# Altium schematic sheet GrainDryer.SchDoc
size A3; SheetNumber: 1; SheetTotal: 1
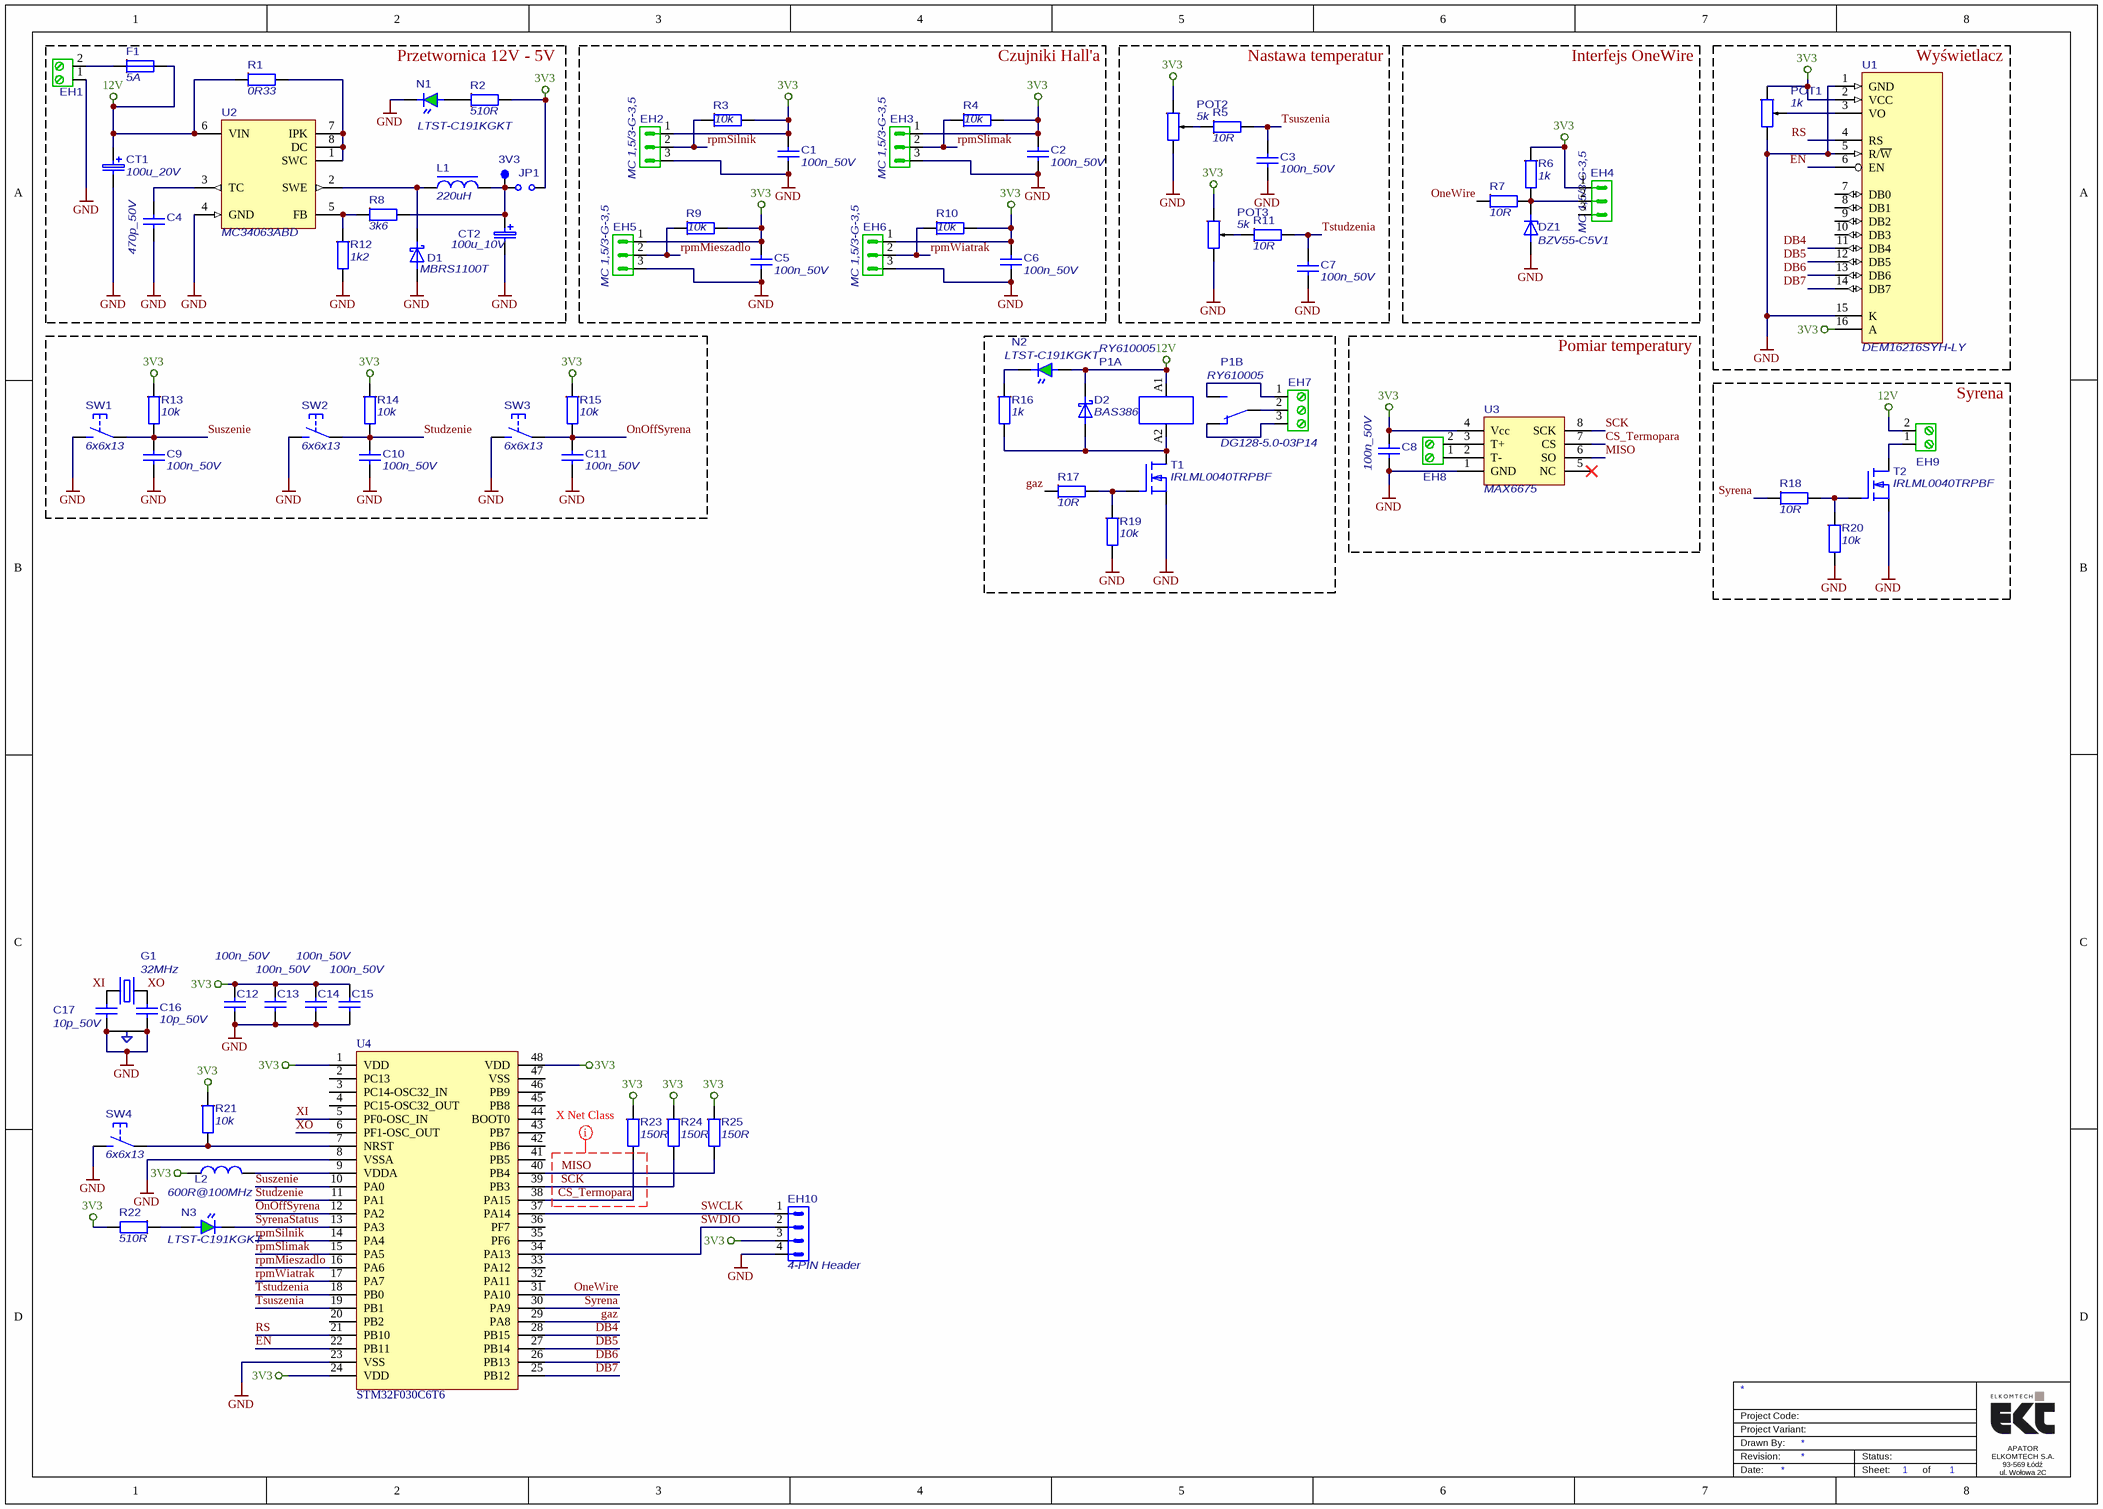
[diagram p0: GrainDryer.SchDoc]

## Parts
3V3  TP_THT  [TP3]  (value not drawn)  (no BOM)
C1  100n_50V  [0603C]
C2  100n_50V  [0603C]
C3  100n_50V  [0603C]
C4  470p_50V  [1206C]
C5  100n_50V  [0603C]
C6  100n_50V  [0603C]
C7  100n_50V  [0603C]
C8  100n_50V  [0603C]
C9  100n_50V  [0603C]
C10  100n_50V  [0603C]
C11  100n_50V  [0603C]
C12  100n_50V  [0603C]
C13  100n_50V  [0603C]
C14  100n_50V  [0603C]
C15  100n_50V  [0603C]
C16  10p_50V  [0603H]
C17  10p_50V  [0603H]
CT1  100u_20V  [7243]
CT2  100u_10V  [7243]
D1  MBRS1100T  [CASE403A-03]
D2  BAS386  [MICROMELF]
DZ1  BZV55-C5V1  [SOD80D]
EH1  MKDSN 1,5/2-5,08  [2xMKDSN1.5]  (value not drawn)
EH2  MC 1,5/3-G-3,5  [MC 1,5/3-G-3,5]
EH3  MC 1,5/3-G-3,5  [MC 1,5/3-G-3,5]
EH4  MC 1,5/3-G-3,5  [MC 1,5/3-G-3,5]
EH5  MC 1,5/3-G-3,5  [MC 1,5/3-G-3,5]
EH6  MC 1,5/3-G-3,5  [MC 1,5/3-G-3,5]
EH7  DG128-5.0-03P14  [DG128-5.0-03P14]
EH8  MKDSN 1,5/2-5,08  [2xMKDSN1.5]  (value not drawn)
EH9  MKDSN 1,5/2-5,08  [2xMKDSN1.5]  (value not drawn)
EH10  4-PIN Header  [SIP4]
F1  5A  [20x5mm fuse holder]
G1  32MHz  [XTAL2520]
JP1  JP_2H_NO  [TIN2]  (value not drawn)  (no BOM)
L1  220uH  [SRR0604]
L2  600R@100MHz  [1206L]
N1  LTST-C191KGKT  [LED0603GREEN]
N2  LTST-C191KGKT  [LED0603GREEN]
N3  LTST-C191KGKT  [LED0603GREEN]
P1  RY610005  [RY6100XX]  (parts A,B of 2)
POT1  1k  [3312J]
POT2  5k  [RK09 vertical]
POT3  5k  [RK09 vertical]
R1  0R33  [2512R]
R2  510R  [0603R]
R3  10k  [0603R]
R4  10k  [0603R]
R5  10R  [0603R]
R6  1k  [0603R]
R7  10R  [0603R]
R8  3k6  [1206R]
R9  10k  [0603R]
R10  10k  [0603R]
R11  10R  [0603R]
R12  1k2  [1206R]
R13  10k  [0603R]
R14  10k  [0603R]
R15  10k  [0603R]
R16  1k  [0603R]
R17  10R  [0603R]
R18  10R  [0603R]
R19  10k  [0603R]
R20  10k  [0603R]
R21  10k  [0603R]
R22  510R  [0603R]
R23  150R  [0603R]
R24  150R  [0603R]
R25  150R  [0603R]
SW1  6x6x13  [SW6x6x13]
SW2  6x6x13  [SW6x6x13]
SW3  6x6x13  [SW6x6x13]
SW4  6x6x13  [SW6x6x13]
T1  IRLML0040TRPBF  [SOT23]
T2  IRLML0040TRPBF  [SOT23]
U1  DEM16216SYH-LY  [LCD2004]
U2  MC34063ABD  [so8]
U3  MAX6675  [SO8]
U4  STM32F030C6T6  [LQFP48(0.5)]

## Blocks framed on the sheet
Przetwornica 12V - 5V: 3V3 C4 CT1 CT2 D1 EH1 F1 JP1 L1 N1 R1 R2 R8 R12 U2
Czujniki Hall'a: C1 C2 C5 C6 EH2 EH3 EH5 EH6 R3 R4 R9 R10
Nastawa temperatur: C3 C7 POT2 POT3 R5 R11
Interfejs OneWire: DZ1 EH4 R6 R7
Wyświetlacz: POT1 U1
Pomiar temperatury: C8 EH8 U3
Syrena: EH9 R18 R20 T2

## Nets
3V3: C1.1 C2.1 C5.1 C6.1 C8.1 C12.1 C13.1 C14.1 C15.1 EH2.1 EH3.1 EH4.1 EH5.1 EH6.1 EH10.3 JP1.2 L2.1 POT1.1 POT2.1 POT3.1 R2.2 R3.2 R4.2 R6.1 R9.2 R10.2 R13.1 R14.1 R15.1 R21.1 R22.2 R23.1 R24.1 R25.1 U1.2(VCC) U1.16(A) U3.4(Vcc) U4.1(VDD) U4.24(VDD) U4.48(VDD)
12V: CT1.1 D2.1(K) EH9.2 F1.2 N2.2(A) P1.A1 R1.1 U2.6(VIN)
GND: C1.2 C2.2 C3.2 C4.1 C5.2 C6.2 C7.2 C8.2 C9.2 C10.2 C11.2 C12.2 C13.2 C14.2 C15.2 C16.2 C17.2 CT1.2 CT2.2 D1.2(A) DZ1.2(A) EH1.1 EH2.3 EH3.3 EH5.3 EH6.3 EH10.4 G1.2(GND) G1.4(GND) N1.1(K) POT1.3 POT2.3 POT3.3 R12.2 R19.2 R20.2 SW1.1 SW2.1 SW3.1 SW4.1 T1.2(S) T2.2(S) U1.1(GND) U1.5(R/~{W}) U1.15(K) U2.4(GND) U3.1(GND) U4.8(VSSA) U4.23(VSS)
CS_Termopara: R23.2 U3.7(CS) U4.38(PA15)
DB4: U1.11(DB4) U4.28(PB15)
DB5: U1.12(DB5) U4.27(PB14)
DB6: U1.13(DB6) U4.26(PB13)
DB7: U1.14(DB7) U4.25(PB12)
EN: U1.6(EN) U4.22(PB11)
gaz: R17.1 U4.29(PA8)
MISO: R25.2 U3.6(SO) U4.40(PB4)
OneWire: R7.1 U4.31(PA10)
OnOffSyrena: C11.1 R15.2 SW3.2 U4.12(PA2)
rpmMieszadlo: EH5.2 R9.1 U4.16(PA6)
rpmSilnik: EH2.2 R3.1 U4.14(PA4)
rpmSlimak: EH3.2 R4.1 U4.15(PA5)
rpmWiatrak: EH6.2 R10.1 U4.17(PA7)
RS: U1.4(RS) U4.21(PB10)
SCK: R24.2 U3.8(SCK) U4.39(PB3)
Studzenie: C10.1 R14.2 SW2.2 U4.11(PA1)
Suszenie: C9.1 R13.2 SW1.2 U4.10(PA0)
SWCLK: EH10.1 U4.37(PA14)
SWDIO: EH10.2 U4.34(PA13)
Syrena: R18.1 U4.30(PA9)
SyrenaStatus: N3.1(K) U4.13(PA3)
Tstudzenia: C7.1 R11.2 U4.18(PB0)
Tsuszenia: C3.1 R5.2 U4.19(PB1)
XI: C17.1 G1.1 U4.5(PF0-OSC_IN)
XO: C16.1 G1.3 U4.6(PF1-OSC_OUT)
Net3V3_1: 3V3.1 CT2.1 JP1.1 L1.1 R8.2
NetC4_2: C4.2 U2.3(TC)
NetD1_1: D1.1(K) L1.2 U2.2(SWE)
NetD2_2: D2.2(A) P1.A2 R16.2 T1.3(D)
NetDZ1_1: DZ1.1(K) EH4.2 R6.2 R7.2
NetEH1_2: EH1.2 F1.1
NetEH7_1: EH7.1 P1.14
NetEH7_2: EH7.2 P1.11
NetEH7_3: EH7.3 P1.12
NetEH8_1: EH8.1 U3.2(T-)
NetEH8_2: EH8.2 U3.3(T+)
NetEH9_1: EH9.1 T2.3(D)
NetL2_2: L2.2 U4.9(VDDA)
NetN1_2: N1.2(A) R2.1
NetN2_1: N2.1(K) R16.1
NetN3_2: N3.2(A) R22.1
NetPOT1_2: POT1.2 U1.3(VO)
NetPOT2_2: POT2.2 R5.1
NetPOT3_2: POT3.2 R11.1
NetR1_2: R1.2 U2.1(SWC) U2.7(IPK) U2.8(DC)
NetR8_1: R8.1 R12.1 U2.5(FB)
NetR17_2: R17.2 R19.1 T1.1(G)
NetR18_2: R18.2 R20.1 T2.1(G)
NetR21_2: R21.2 SW4.2 U4.7(NRST)

Not connected (* = marked no-connect by the designer): EH4 3; U1 7(DB0) 8(DB1) 9(DB2) 10(DB3); U3 5(NC)*; U4 2(PC13) 3(PC14-OSC32_IN) 4(PC15-OSC32_OUT) 20(PB2) 32(PA11) 33(PA12) 35(PF6) 36(PF7) 41(PB5) 42(PB6) 43(PB7) 44(BOOT0) 45(PB8) 46(PB9) 47(VSS)

## Layout directives
net class X Net Class: CS_Termopara, MISO, SCK

## Notes on the sheet
- Drawn By:
- Revision:
- Project Code:
- Project Variant:
- Status:
- Date:
- Sheet:
- of
- APATOR ELKOMTECH S.A.
  93-569 Łódź
  ul. Wołowa 2C

## Library data of the parts
3V3 = TP THT Dia: 0,7mm: Test Point, THT; Component Type: REF
C1-C3 C5-C15 = 100n 10% 50V 0603 [Metric: 1608] X7R: Capacitor; Manufacturer: MULTICOMP; Manufacturer Part Number: MC0603B104K500CT; Tolerance: 10; Voltage Rating: 50; Pick and Place: 100n_50V_MULTICOMP_MC0603B104K500CT; AE ERP: ZCS000046; Component Type: SMD; Value: 100n_50V
C4 = 470p 5% 50V 1206 [Metric: 3216]: Capacitor; Manufacturer: KEMET; Manufacturer Part Number: C1206C471J5GAC7800; Tolerance: 5; Voltage Rating: 50; Pick and Place: 470p_50V_KEMET_C1206C471J5GAC7800; AE ERP: ZCS000038; Component Type: SMD; Value: 470p_50V
C16 C17 = 10p 5% 50V 0603 [Metric: 1608] C0G: Capacitor; Manufacturer: KEMET; Manufacturer Part Number: C0603C100J5GACTU; Tolerance: 5; Voltage Rating: 50; Pick and Place: 10p_50V_KEMET_C0603C100J5GACTU; AE ERP: ZCS000060; Component Type: SMD; Value: 10p_50V
CT1 = 100u 10% 20V 2917 [Metric: 7343] 0R085: Tantalum Capacitor; Manufacturer: AVX; Manufacturer Part Number: TPSD107K020R0085; Pick and Place: 100u_20V_AVX_TPSD107K020R0085; Component Type: SMD; Value: 100u_20V
CT2 = 100u 10% 10V 2917 [Metric: 7343] 0R065: Tantalum Capacitor; Manufacturer: AVX; Manufacturer Part Number: TPSD107K010R0065; Tolerance: 10; Pick and Place: 100u_10V_AVX_TPSD107K010R0065; AE ERP: ZCTS00014; Component Type: SMD; Voltage Rating: 10; Value: 100u_10V
D1 = MBRS1100T3G 100V 1A SMB: Schottky Diodes & Rectifiers; Manufacturer: ON SEMICONDUCTOR; Pick and Place: ON SEMICONDUCTOR_MBRS1100T3G; AE ERP: ZDS000019; Component Type: SMD; Manufacturer Part Number: MBRS1100T3G; Value: MBRS1100T
D2 = BAS386-TR 50V 0,1A Micro MELF: Schottky Diode; Manufacturer: VISHAY; Pick and Place: VISHAY_BAS386-TR; AE ERP: ZDS000055; Component Type: SMD; Manufacturer Part Number: BAS386-TR; Value: BAS386
DZ1 = BZV55-C5V1 5,1V 2uA 500mW SOD-80: Zener Diodes; Manufacturer: NXP; Current: 2u; Power: 0,5; Pick and Place: NXP_BZV55-C5V1; AE ERP: ZDS000064; Component Type: SMD; Manufacturer Part Number: BZV55-C5V1; Value: BZV55-C5V1; Supplier 1: Farnell; Supplier Part Number 1: 1097202
EH1 EH8 EH9 = MKDSN 1,5/2-5,08 1729128: Term. block 13,5A 250V; Manufacturer: PHOENIX CONTACT; Pick and Place: PHOENIX CONTACT_1729128; Component Type: THT; Manufacturer Part Number: 1729128; Value: MKDSN 1,5/2-5,08
EH2-EH6 = MC 1,5/3-G-3,5 1844223: Header 8A 250V; Manufacturer: PHOENIX CONTACT; Pick and Place: PHOENIX CONTACT_1844223; AE ERP: ZPH000303; Component Type: THT; Manufacturer Part Number: 1844223; Value: MC 1,5/3-G-3,5
EH7 = DG128-5.0-03P14: Term. block 5mm; Manufacturer: DEGSON ELECTRONICS; Manufacturer Part Number: DG128-5.0-03P-14-00A(H); Pick and Place: DEGSON ELECTRONICS_DG128-5.0-03P-14-00A(H); AE ERP: ZE0000057; Component Type: THT; Value: DG128-5.0-03P14
EH10 = 4-PIN Header 2,54 DS1021-1*4SF1-1: 1x4, Male, Pitch 2,54mm; Manufacturer: CONNFLY; Pick and Place: CONNFLY_DS1021-1*4SF1-1; Component Type: THT; Manufacturer Part Number: DS1021-1*4SF1-1; Value: 4-PIN Header
F1 = 5A fuse 20x5mm: Fuse; Manufacturer: multicom; Manufacturer Part Number: MC000827; Pick and Place: 5A_multicom_MC000827; Component Type: THT; Value: 5A
G1 = 32.00M-SMDXT224 25MHz 30ppm -V 2,6x2,1: 25MHz; ±30ppm; 20pF; SMD; 2,6x2,1x0,65mm; Manufacturer: YIC; Pick and Place: YIC_32.00M-SMDXT224; Component Type: SMD; Manufacturer Part Number: 32.00M-SMDXT224; Value: 32MHz
JP1 = JP 2H NO: Jumper 2-contact, normally open
L1 = 220uH 0,25A 6,5x6,5x4,8: Power shielded 1R7; Manufacturer: BOURNS; Manufacturer Part Number: SRR0604-221KL; Tolerance: 10; Maximum DC Current: 0,25; Pick and Place: 220uH_BOURNS_SRR0604-221KL; AE ERP: ZLS000014; Component Type: SMD; Value: 220uH
L2 = 600R@100MHz 1,5A 1206: EMI; Manufacturer: MURATA; Manufacturer Part Number: BLM31PG601SN1; Tolerance: 25; Maximum DC Current: 1,5; Pick and Place: 600R@100MHz_MURATA_BLM31PG601SN1; Component Type: SMD; Value: 600R@100MHz
N1-N3 = LTST-C191KGKT Green 0603 [Metric: 1608]: LED SMD 12mcd; Manufacturer: LITE-ON; Luminous Intensity: 12; Current: 20m; Pick and Place: LITE-ON_LTST-C191KGKT; AE ERP: ZNS000027; Component Type: SMD; Colour: Green; Manufacturer Part Number: LTST-C191KGKT; Value: LTST-C191KGKT
P1 = RY610005: General Purpose Relays SPDT 8 A 5VDC; Manufacturer: SCHRACK; Component Type: THT; Manufacturer Part Number: RY610005; Supplier 1: Allied; Supplier Part Number 1: 70225359; Value: RY610005
POT1 = 1k 20% 0,1W SMD: Potentiometer; Manufacturer: BOURNS; Manufacturer Part Number: 3312J-1-102E; Tolerance: 20; Power Rating: 0,1; Pick and Place: 1k_BOURNS_3312J-1-102E; Component Type: SMD; Value: 1k
POT2 POT3 = 5k 20% 1/8W THT RK09: Potentiometer; Manufacturer: SR PASSIVES; Manufacturer Part Number: R9011-1-5K; Tolerance: 20; Power Rating: 0,125; Pick and Place: 5k_SR PASSIVES_R9011-1-5K; Component Type: THT; Value: 5k
R1 = 0R33 5% 1W 2512 [Metric: 6432]: Resistor; Manufacturer: YAGEO; Manufacturer Part Number: RL2512JK-070R02L; Tolerance: 5; Power Rating: 1; Pick and Place: 0R33_YAGEO_RL2512JK-070R02L; Component Type: SMD; Value: 0R33
R2 R22 = 510R 5% 0,1W 0603 [Metric: 1608]: Resistor; Manufacturer: YAGEO; Manufacturer Part Number: RC0603JR-07510RL; Tolerance: 5; Power Rating: 0,1; Pick and Place: 510R_YAGEO_RC0603JR-07510RL; AE ERP: ZRS000155; Component Type: SMD; Value: 510R
R3 R4 R9 R10 R13-R15 R19-R21 = 10k 5% 0,1W 0603 [Metric: 1608]: Resistor; Manufacturer: YAGEO; Manufacturer Part Number: RC0603JR-0710KL; Tolerance: 5; Power Rating: 0,1; Pick and Place: 10k_YAGEO_RC0603JR-0710KL; AE ERP: ZRS000147; Component Type: SMD; Value: 10k
R5 R7 R11 R17 R18 = 10R 1% 0,1W 0603 [Metric: 1608]: Resistor; Manufacturer: PANASONIC; Manufacturer Part Number: ERJ3EKF10R0V; Tolerance: 1; Power Rating: 0,1; Pick and Place: 10R_PANASONIC_ERJ3EKF10R0V; Component Type: SMD; Value: 10R; AE ERP: ERJ3EKF10R0V
R6 R16 = 1k 5% 0,1W 0603 [Metric: 1608]: Resistor; Manufacturer: YAGEO; Manufacturer Part Number: RC0603JR-071KL; Tolerance: 5; Power Rating: 0,1; Pick and Place: 1k_YAGEO_RC0603JR-071KL; AE ERP: ZRS000144; Component Type: SMD; Value: 1k
R8 = 3k6 1% 0,25W 1206 [Metric: 3216]: Resistor; Manufacturer: PANASONIC; Manufacturer Part Number: ERJ8ENF3601V; Tolerance: 1; Power Rating: 0,25; Pick and Place: 3k6_PANASONIC_ERJ8ENF3601V; AE ERP: ZRS000025; Component Type: SMD; Value: 3k6
R12 = 1k2 1% 0,25W 1206 [Metric: 3216]: Resistor; Manufacturer: ROYAL OHM; Manufacturer Part Number: 1206S4F0122T5E; Tolerance: 1; Power Rating: 0,25; Pick and Place: 1k2_ROYAL OHM_1206S4F0122T5E; Component Type: SMD; Value: 1k2
R23-R25 = 150R 5% 0,1W 0603 [Metric: 1608]: Resistor; Manufacturer: YAGEO; Manufacturer Part Number: RC0603JR-07150RL; Tolerance: 5; Power Rating: 0,1; Pick and Place: 150R_YAGEO_RC0603JR-07150RL; AE ERP: ZRS000195; Component Type: SMD; VALUE: 150R
SW1-SW4 = SW6x6x13: SW 6x6x13; Manufacturer: NINIGI; Manufacturer Part Number: TACT-613N-F; Pick and Place: NINIGI_TACT-613N-F; Component Type: THT; Value: 6x6x13
T1 T2 = IRLML0040TRPBF N 3,6A 40V SOT-23: N-MOS 40V 3.6A 56mOhm 2.6nC Qg; Manufacturer: INTERNATIONAL RECTIFIER; Current: 3,6; Pick and Place: INTERNATIONAL RECTIFIER_IRLML0040TRPBF; Component Type: SMD; Manufacturer Part Number: IRLML0040TRPBF; Value: IRLML0040TRPBF
U1 = LCD2004: LCD 4x20 93 x 55 mm 5V BL; Manufacturer: DISPLAY ELEKTRONIK; Pick and Place: DISPLAY ELEKTRONIK_DEM16216SYH-LY; Component Type: THT; Manufacturer Part Number: DEM16216SYH-LY; Value: DEM16216SYH-LY
U2 = MC34063A: DC-DC converter; Manufacturer: STMICROELECTRONICS; Pick and Place: STMICROELECTRONICS_MC34063ABD; AE ERP: ZUS000391; Component Type: SMD; Manufacturer Part Number: MC34063ABD; Value: MC34063ABD
U3 = MAX6675: Cold-Junction-Compensated K-Thermocouple-to-Digital Converter; Manufacturer: Maxim Integrated; Pick and Place: Maxim Integrated_MAX6675; Component Type: SMD; Manufacturer Part Number: MAX6675; Value: MAX6675
U4 = STM32F030C6T6: Cortex M0, Flash 32k RAM 8k; Manufacturer: STMICROELECTRONICS; Pick and Place: STMICROELECTRONICS_STM32F030C6T6; Component Type: SMD; Manufacturer Part Number: STM32F030C6T6; Value: STM32F030C6T6